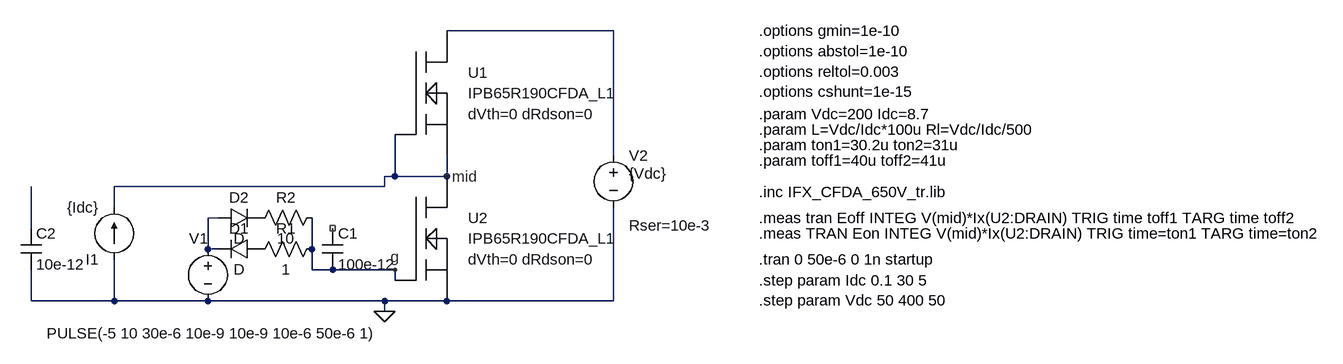
[diagram p0: schematic DoublePulseTester_IPW65R190CFDA_L1.asc]
DoublePulseTester_IPW65R190CFDA_L1.asc, the LTspice schematic file:
Version 4
SHEET 1 1812 1012
WIRE 208 496 -48 496
WIRE 208 688 208 496
WIRE -128 720 -128 656
WIRE -128 720 -144 720
WIRE -48 720 -48 688
WIRE -48 720 -128 720
WIRE -144 736 -144 720
WIRE -144 736 -560 736
WIRE -560 768 -560 736
WIRE -400 784 -416 784
WIRE -688 800 -688 736
WIRE -416 832 -416 784
WIRE -400 832 -416 832
WIRE -256 832 -256 784
WIRE -256 864 -256 832
WIRE -224 864 -256 864
WIRE -128 864 -224 864
WIRE -128 880 -128 864
WIRE -688 912 -688 864
WIRE -560 912 -560 848
WIRE -560 912 -688 912
WIRE -416 912 -560 912
WIRE -144 912 -416 912
WIRE -48 912 -144 912
WIRE 208 912 208 768
WIRE 208 912 -48 912
WIRE -144 928 -144 912
FLAG -144 928 0
FLAG -48 720 mid
FLAG -128 864 g
SYMBOL voltage -416 816 R0
WINDOW 3 -248 146 Left 2
WINDOW 123 0 0 Left 2
WINDOW 39 0 0 Left 2
WINDOW 0 -29 0 Left 2
SYMATTR Value PULSE(-5 10 30e-6 10e-9 10e-9 10e-6 50e-6 1)
SYMATTR InstName V1
SYMBOL res -240 816 R90
WINDOW 0 0 56 VBottom 2
WINDOW 3 32 56 VTop 2
SYMATTR InstName R1
SYMATTR Value 1
SYMBOL voltage 208 672 R0
WINDOW 123 0 0 Left 2
WINDOW 39 24 124 Left 2
WINDOW 3 24 44 Left 2
SYMATTR SpiceLine Rser=10e-3
SYMATTR Value {Vdc}
SYMATTR InstName V2
SYMBOL current -560 848 R180
WINDOW 123 0 0 Left 2
WINDOW 39 0 0 Left 2
SYMATTR InstName I1
SYMATTR Value {Idc}
SYMBOL cap -240 800 R0
SYMATTR InstName C1
SYMATTR Value 100e-12
SYMBOL diode -336 816 R90
WINDOW 0 0 32 VBottom 2
WINDOW 3 32 32 VTop 2
SYMATTR InstName D1
SYMBOL diode -400 800 R270
WINDOW 0 32 32 VTop 2
WINDOW 3 0 32 VBottom 2
SYMATTR InstName D2
SYMBOL res -240 768 R90
WINDOW 0 0 56 VBottom 2
WINDOW 3 32 56 VTop 2
SYMATTR InstName R2
SYMATTR Value 10
SYMBOL cap -704 800 R0
SYMATTR InstName C2
SYMATTR Value 10e-12
SYMBOL IPB65R190CFDA_L1 -64 576 R0
SYMATTR InstName U1
SYMBOL IPB65R190CFDA_L1 -64 800 R0
SYMATTR InstName U2
TEXT 432 848 Left 2 !.tran 0 50e-6 0 1n startup
TEXT 432 744 Left 2 !.inc IFX_CFDA_650V_tr.lib
TEXT 432 784 Left 2 !.meas tran Eoff INTEG V(mid)*Ix(U2:DRAIN) TRIG time toff1 TARG time toff2
TEXT 432 696 Left 2 !.param toff1=40u toff2=41u
TEXT 432 808 Left 2 !.meas TRAN Eon INTEG V(mid)*Ix(U2:DRAIN) TRIG time=ton1 TARG time=ton2
TEXT 432 672 Left 2 !.param ton1=30.2u ton2=31u
TEXT 432 648 Left 2 !.param L=Vdc/Idc*100u Rl=Vdc/Idc/500
TEXT 432 624 Left 2 !.param Vdc=200 Idc=8.7
TEXT 432 880 Left 2 !.step param Idc 0.1 30 5\n.step param Vdc 50 400 50
TEXT 432 496 Left 2 !.options gmin=1e-10\n.options abstol=1e-10\n.options reltol=0.003\n.options cshunt=1e-15

The netlist it stands for:
* DoublePulseTester_IPW65R190CFDA_L1.asc
V1 N002 0 PULSE(-5 10 30e-6 10e-9 10e-9 10e-6 50e-6 1)
R1 g P001 1
V2 N001 0 {Vdc} Rser=10e-3
I1 0 mid {Idc}
C1 NC_01 g 100e-12
D1 P001 N002 D
D2 N002 P002 D
R2 g P002 10
C2 N003 0 10e-12
XU1 N001 mid mid IPB65R190CFDA_L1 dVth=0 dRdson=0  ; pins drain gate source
XU2 mid g 0 IPB65R190CFDA_L1 dVth=0 dRdson=0  ; pins drain gate source
.model D D
.lib standard.dio
.tran 0 50e-6 0 1n startup
.inc IFX_CFDA_650V_tr.lib
.meas tran Eoff INTEG V(mid)*Ix(U2:DRAIN) TRIG time toff1 TARG time toff2
.param toff1=40u toff2=41u
.meas TRAN Eon INTEG V(mid)*Ix(U2:DRAIN) TRIG time=ton1 TARG time=ton2
.param ton1=30.2u ton2=31u
.param L=Vdc/Idc*100u Rl=Vdc/Idc/500
.param Vdc=200 Idc=8.7
.step param Idc 0.1 30 5
.step param Vdc 50 400 50
.options gmin=1e-10
.options abstol=1e-10
.options reltol=0.003
.options cshunt=1e-15
.lib IFX_CFDA_650V_tr.lib
.backanno
.end